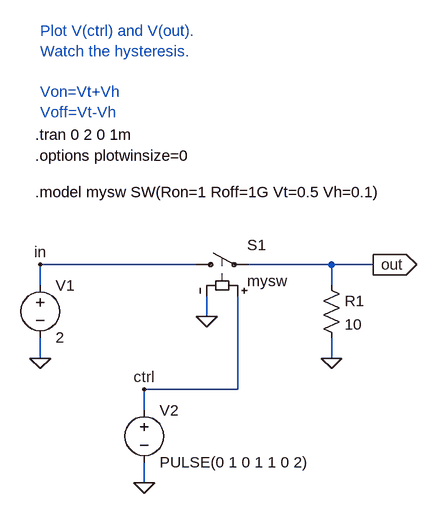
[diagram p0: schematic switch_with_hysteresis.asc]
switch_with_hysteresis.asc, the LTspice schematic file:
Version 4
SHEET 1 880 680
WIRE -160 128 -160 96
WIRE -160 240 -160 208
WIRE 0 320 0 288
WIRE 0 432 0 400
WIRE 80 96 -160 96
WIRE 96 176 96 144
WIRE 144 288 0 288
WIRE 144 288 144 144
WIRE 288 96 160 96
WIRE 288 128 288 96
WIRE 288 240 288 208
WIRE 352 96 288 96
FLAG -160 240 0
FLAG 96 176 0
FLAG 288 240 0
FLAG 352 96 out
IOPIN 352 96 Out
FLAG 0 288 ctrl
FLAG -160 96 in
FLAG 0 432 0
SYMBOL sw 64 96 R270
WINDOW 0 30 94 VRight 0
WINDOW 3 -25 94 VRight 0
SYMATTR InstName S1
SYMATTR Value mysw
SYMBOL voltage -160 112 R0
SYMATTR InstName V1
SYMATTR Value 2
SYMBOL voltage 0 304 R0
WINDOW 123 0 0 Left 0
WINDOW 39 0 0 Left 0
SYMATTR InstName V2
SYMATTR Value PULSE(0 1 0 1 1 0 2)
SYMBOL res 272 112 R0
SYMATTR InstName R1
SYMATTR Value 10
TEXT -160 -264 Left 0 ;Plot V(ctrl) and V(out).\nWatch the hysteresis.\n \nVon=Vt+Vh\nVoff=Vt-Vh
TEXT -168 -16 Left 0 !.model mysw SW(Ron=1 Roff=1G Vt=0.5 Vh=0.1)
TEXT -168 -104 Left 0 !.tran 0 2 0 1m
TEXT -168 -72 Left 0 !.options plotwinsize=0

The netlist it stands for:
* switch_with_hysteresis.asc
S1 in out ctrl 0 mysw
V1 in 0 2
V2 ctrl 0 PULSE(0 1 0 1 1 0 2)
R1 out 0 10
* Plot V(ctrl) and V(out).
* Watch the hysteresis.
* Von=Vt+Vh
* Voff=Vt-Vh
.model mysw SW(Ron=1 Roff=1G Vt=0.5 Vh=0.1)
.tran 0 2 0 1m
.options plotwinsize=0
.backanno
.end